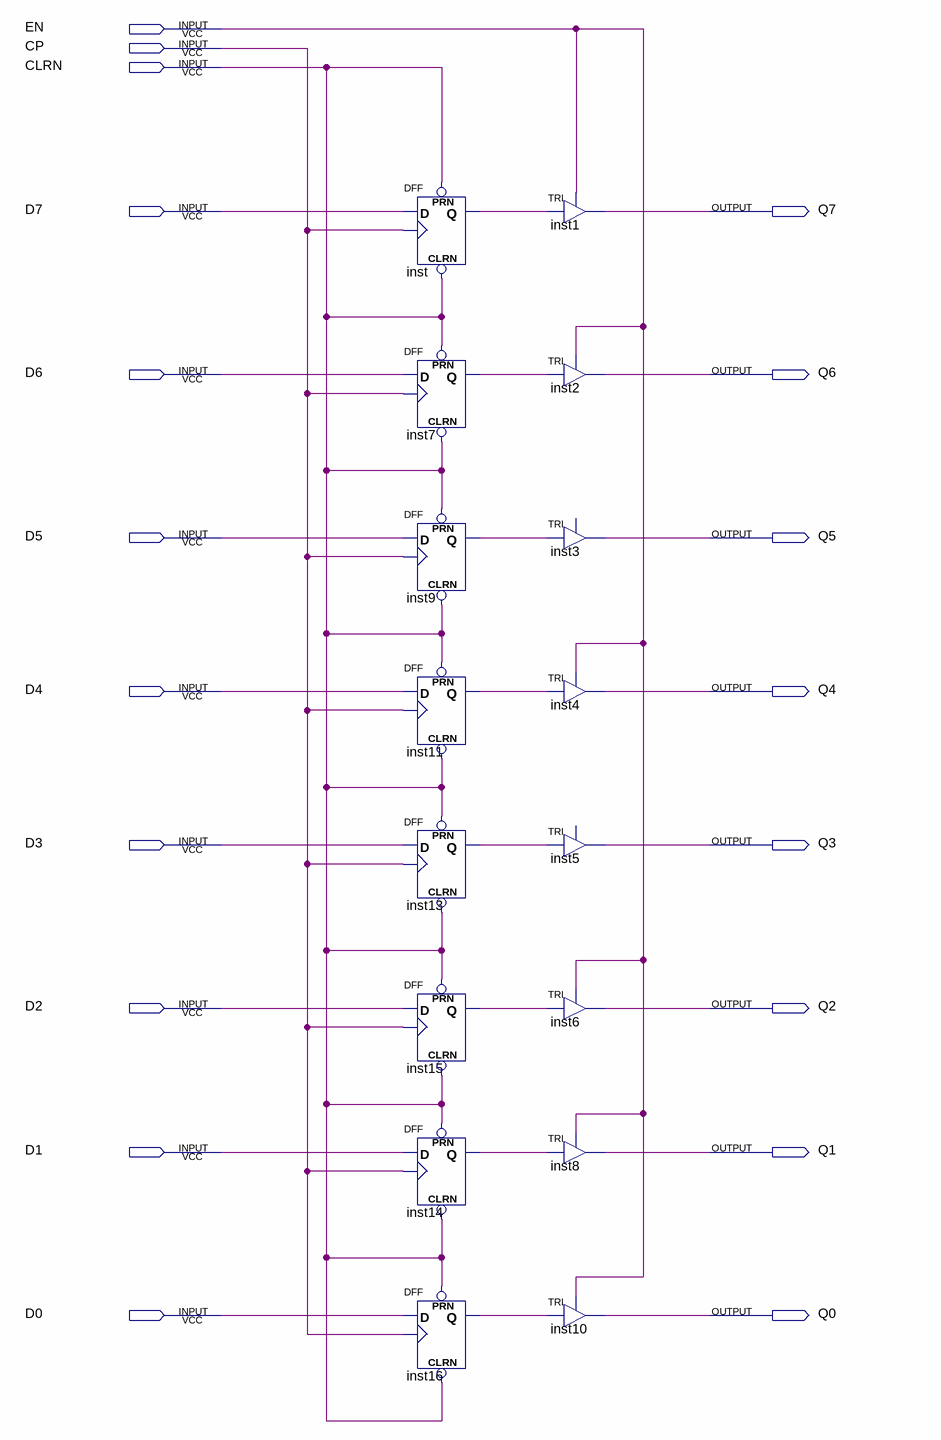
[diagram p0: schematic sheet]
// Quartus schematic register8_with_clrn_tri.bdf as structural Verilog: 16 symbols, 19 pins
module register8_with_clrn_tri (
  input  EN,
  input  CP,
  input  CLRN,
  input  D7,
  input  D6,
  input  D5,
  input  D4,
  input  D3,
  input  D2,
  input  D1,
  input  D0,
  output Q7,
  output Q6,
  output Q5,
  output Q4,
  output Q3,
  output Q2,
  output Q1,
  output Q0
);

  wire inst7_q, inst9_q, inst11_q, inst13_q, inst14_q, inst15_q, inst16_q, inst_q;

  DFF inst (.CLRN(CLRN), .CLK(CP), .D(D7), .PRN(CLRN), .Q(inst_q));
  DFF inst7 (.CLRN(CLRN), .CLK(CP), .D(D6), .PRN(CLRN), .Q(inst7_q));
  DFF inst9 (.CLRN(CLRN), .CLK(CP), .D(D5), .PRN(CLRN), .Q(inst9_q));
  DFF inst11 (.CLRN(CLRN), .CLK(CP), .D(D4), .PRN(CLRN), .Q(inst11_q));
  DFF inst13 (.CLRN(CLRN), .CLK(CP), .D(D3), .PRN(CLRN), .Q(inst13_q));
  DFF inst15 (.CLRN(CLRN), .CLK(CP), .D(D2), .PRN(CLRN), .Q(inst15_q));
  DFF inst14 (.CLRN(CLRN), .CLK(CP), .D(D1), .PRN(CLRN), .Q(inst14_q));
  DFF inst16 (.CLRN(CLRN), .CLK(CP), .D(D0), .PRN(CLRN), .Q(inst16_q));
  TRI inst1 (.IN(inst_q), .OE(EN), .OUT(Q7));
  TRI inst2 (.IN(inst7_q), .OE(EN), .OUT(Q6));
  TRI inst3 (.IN(inst9_q), .OUT(Q5));  // open: OE
  TRI inst4 (.IN(inst11_q), .OE(EN), .OUT(Q4));
  TRI inst5 (.IN(inst13_q), .OUT(Q3));  // open: OE
  TRI inst6 (.IN(inst15_q), .OE(EN), .OUT(Q2));
  TRI inst8 (.IN(inst14_q), .OE(EN), .OUT(Q1));
  TRI inst10 (.IN(inst16_q), .OE(EN), .OUT(Q0));
endmodule
